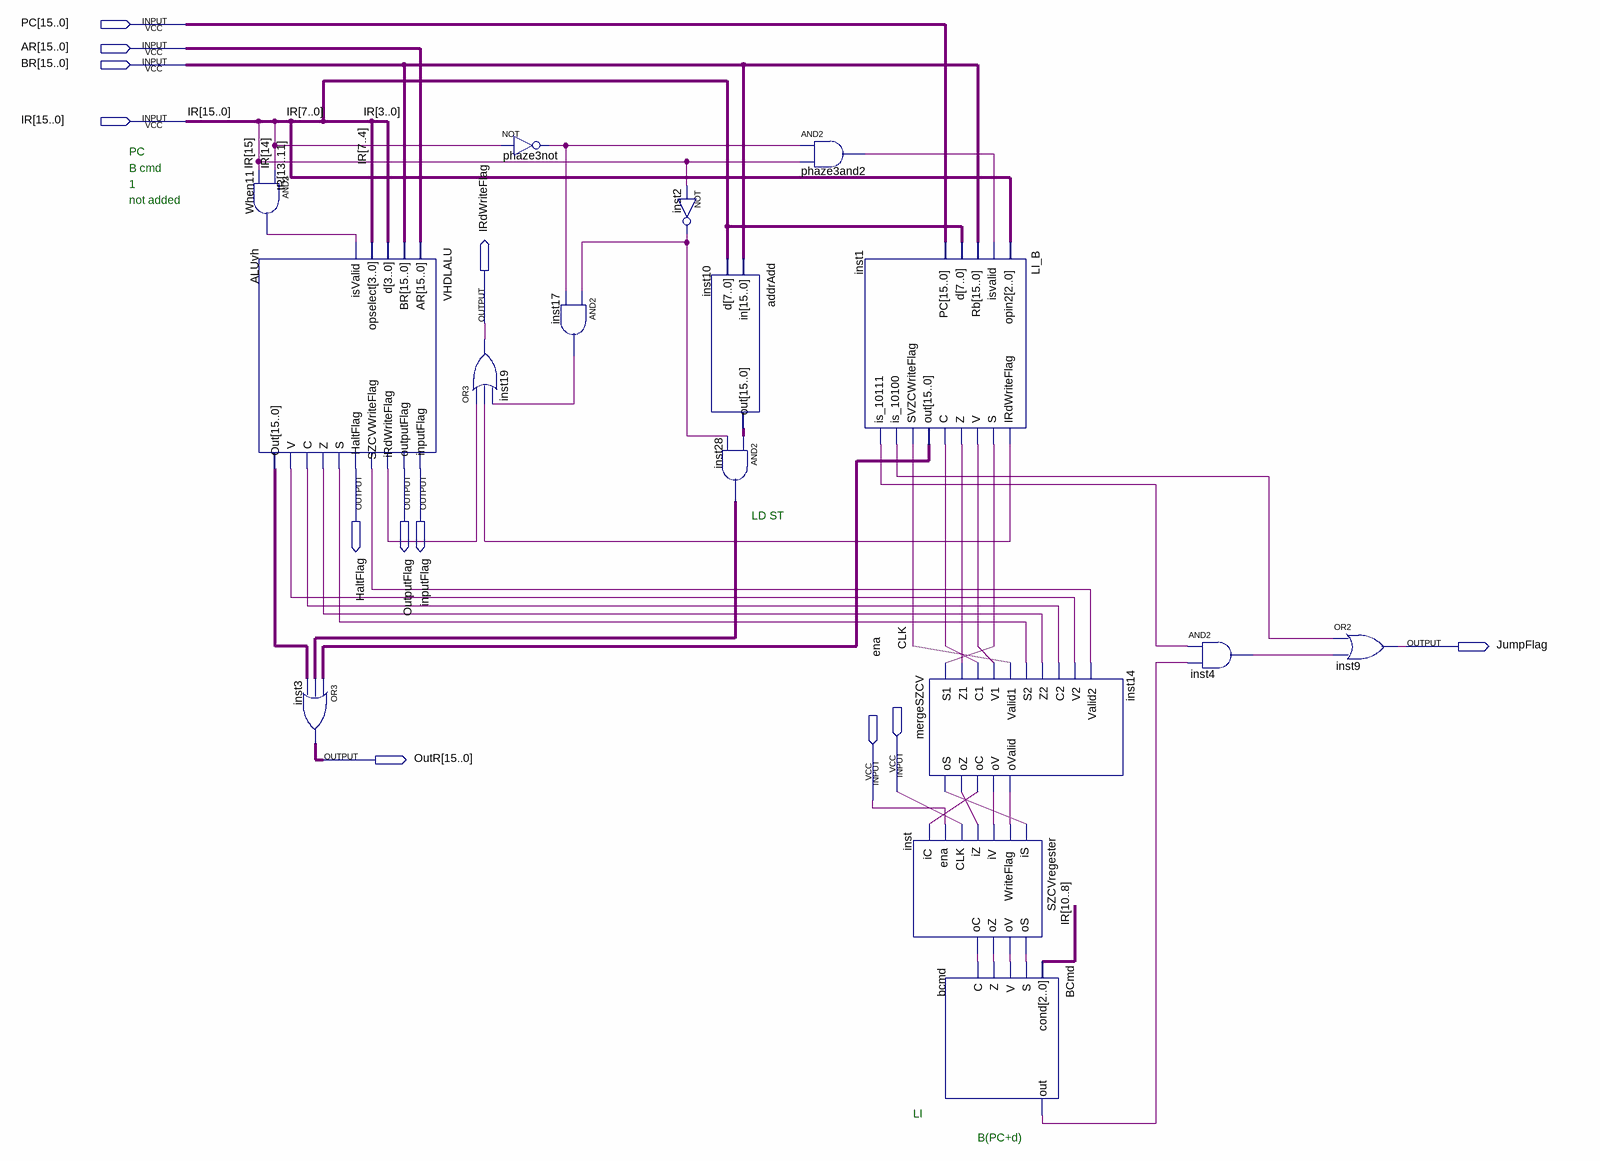
[diagram p0: schematic sheet]
// Quartus schematic phaze3.bdf as structural Verilog: 16 symbols, 12 pins
module phaze3 (
  input  [15:0] PC,
  input  [15:0] AR,
  input  [15:0] BR,
  input  [15:0] IR,
  input  CLK,
  input  ena,
  output IRdWriteFlag,
  output HaltFlag,
  output OutputFlag,
  output inputFlag,
  output JumpFlag,
  output [15:0] OutR
);

  wire ALUvh_c, ALUvh_irdwriteflag, ALUvh_s, ALUvh_szcvwriteflag, ALUvh_v, ALUvh_z, bcmd_out, inst1_c,
       inst1_irdwriteflag, inst1_is_10100, inst1_is_10111, inst1_s, inst1_svzcwriteflag, inst1_v, inst1_z,
       inst2_out, inst4_out, inst14_oc, inst14_os, inst14_ov, inst14_ovalid, inst14_oz, inst17_out, inst_oc,
       inst_os, inst_ov, inst_oz, phaze3and2_out, phaze3not_out, When11_out;
  wire [15:0] ALUvh_out, inst1_out, inst10_out, inst28_out;

  and When11 (When11_out, IR[14], IR[15]);
  VHDLALU ALUvh (
    .AR(AR), .BR(BR), .d(IR[3:0]), .opselect(IR[7:4]), .isValid(When11_out), .inputFlag(inputFlag),
    .outputFlag(OutputFlag), .iRdWriteFlag(ALUvh_irdwriteflag), .SZCVWriteFlag(ALUvh_szcvwriteflag),
    .HaltFlag(HaltFlag), .S(ALUvh_s), .Z(ALUvh_z), .C(ALUvh_c), .V(ALUvh_v), .Out(ALUvh_out));
  assign OutR = inst1_out | inst28_out | ALUvh_out;  // OR3 inst3, 16 bits wide
  or inst19 (IRdWriteFlag, ALUvh_irdwriteflag, inst1_irdwriteflag, inst17_out);
  not phaze3not (phaze3not_out, IR[14]);
  and inst17 (inst17_out, inst2_out, phaze3not_out);
  not inst2 (inst2_out, IR[15]);
  addrAdd inst10 (.in(BR), .d(IR[7:0]), .out(inst10_out));
  assign inst28_out = inst10_out & {16{inst2_out}};  // AND2 inst28, 16 bits wide
  and phaze3and2 (phaze3and2_out, phaze3not_out, IR[15]);
  LI_B inst1 (
    .opin2(IR[13:11]), .isvalid(phaze3and2_out), .Rb(BR), .d(IR[7:0]), .PC(PC),
    .IRdWriteFlag(inst1_irdwriteflag), .S(inst1_s), .V(inst1_v), .Z(inst1_z), .C(inst1_c), .out(inst1_out),
    .SVZCWriteFlag(inst1_svzcwriteflag), .is_10100(inst1_is_10100), .is_10111(inst1_is_10111));
  mergeSZCV inst14 (
    .S1(inst1_s), .Z1(inst1_z), .C1(inst1_c), .V1(inst1_v), .Valid1(inst1_svzcwriteflag), .S2(ALUvh_s),
    .Z2(ALUvh_z), .C2(ALUvh_c), .V2(ALUvh_v), .Valid2(ALUvh_szcvwriteflag), .oS(inst14_os), .oZ(inst14_oz),
    .oC(inst14_oc), .oV(inst14_ov), .oValid(inst14_ovalid));
  SZCVregester inst (
    .iS(inst14_os), .WriteFlag(inst14_ovalid), .iV(inst14_ov), .iZ(inst14_oz), .CLK(CLK), .ena(ena),
    .iC(inst14_oc), .oS(inst_os), .oV(inst_ov), .oZ(inst_oz), .oC(inst_oc));
  BCmd bcmd (.cond(IR[10:8]), .S(inst_os), .V(inst_ov), .Z(inst_oz), .C(inst_oc), .out(bcmd_out));
  and inst4 (inst4_out, inst1_is_10111, bcmd_out);
  or inst9 (JumpFlag, inst1_is_10100, inst4_out);

  // Notes on the sheet:
  //   PC 
  //   B cmd
  //   1 
  //   not added
  //   LD ST
  //   LI
  //   B(PC+d)
endmodule
